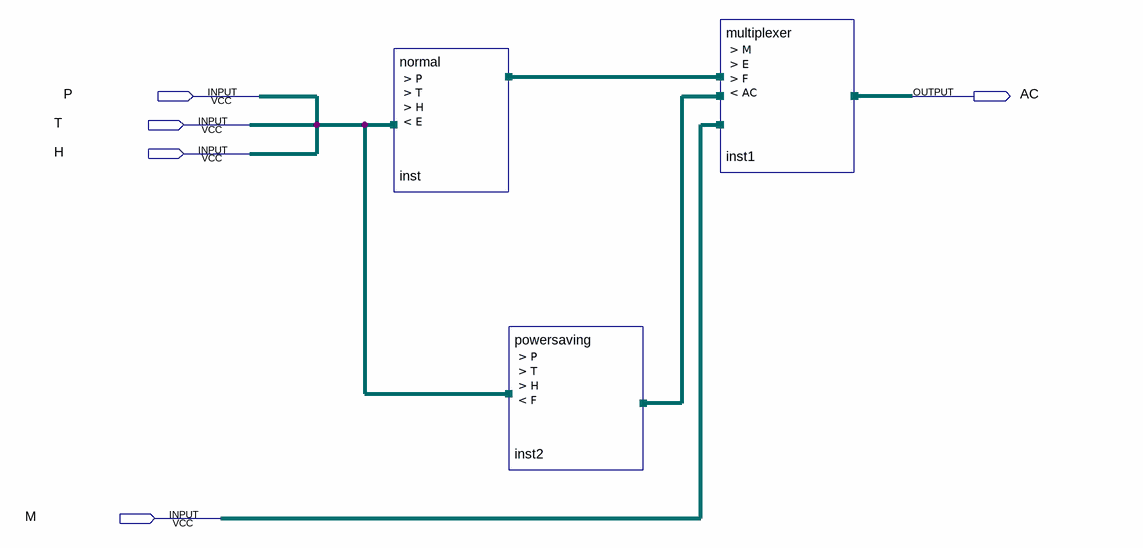
[diagram p0: schematic sheet]
// Quartus schematic lab4step2.bdf as structural Verilog: 3 symbols, 5 pins
module lab4step2 (
  input  P,
  input  T,
  input  H,
  input  M,
  output AC
);

  wire E, F;

  normal inst (.P(P), .T(T), .H(H), .E(E));
  powersaving inst2 (.P(P), .T(T), .H(H), .F(F));
  multiplexer inst1 (.M(M), .E(E), .F(F), .AC(AC));
endmodule
